# Altium schematic sheet MezcladorBF998.SchDoc
size A4
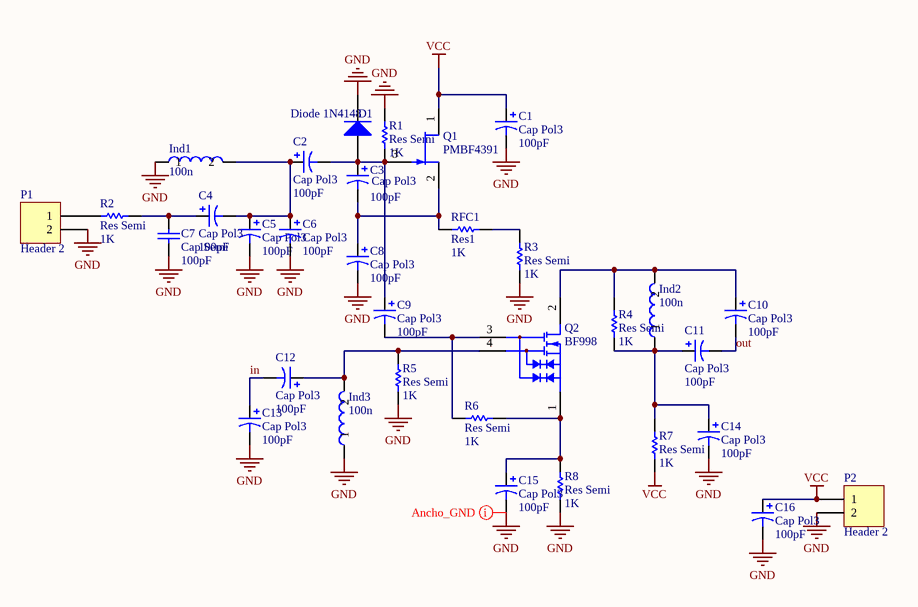
[diagram p0: MezcladorBF998.SchDoc]

## Parts
C1  Cap Pol3  value 100pF  [C0805]
C2  Cap Pol3  value 100pF  [C0805]
C3  Cap Pol3  value 100pF  [C0805]
C4  Cap Pol3  value 100pF  [C0805]
C5  Cap Pol3  value 100pF  [C0805]
C6  Cap Pol3  value 100pF  [C0805]
C7  Cap Semi  value 100pF  [C1206]
C8  Cap Pol3  value 100pF  [C0805]
C9  Cap Pol3  value 100pF  [C0805]
C10  Cap Pol3  value 100pF  [C0805]
C11  Cap Pol3  value 100pF  [C0805]
C12  Cap Pol3  value 100pF  [C0805]
C13  Cap Pol3  value 100pF  [C0805]
C14  Cap Pol3  value 100pF  [C0805]
C15  Cap Pol3  value 100pF  [C0805]
C16  Cap Pol3  value 100pF  [C0805]
D1  Diode 1N4148  [DO-35]
Ind1  Valor: 100n  [Ind_3mm]  (hidden comment: Ind2)
Ind2  Valor: 100n  [IND_7MM]  (hidden comment: Ind2)
Ind3  Valor: 100n  [Ind_4mm]  (hidden comment: Ind2)
P1  Header 2  [HDR1X2]
P2  Header 2  [HDR1X2]
Q1  PMBF4391  [SOT23]
Q2  BF998  [SOT143]
R1  Res Semi  value 1K  [2012[0805]]
R2  Res Semi  value 1K  [2012[0805]]
R3  Res Semi  value 1K  [2012[0805]]
R4  Res Semi  value 1K  [2012[0805]]
R5  Res Semi  value 1K  [2012[0805]]
R6  Res Semi  value 1K  [2012[0805]]
R7  Res Semi  value 1K  [2012[0805]]
R8  Res Semi  value 1K  [2012[0805]]
RFC1  Res1  value 1K  [AXIAL-0.3]

## Nets
GND: C1.2 C5.2 C6.2 C7.2 C8.2 C13.2 C14.2 C15.2 C16.2 D1.2(K) Ind1.1 Ind3.1 P1.2 P2.2 R1.2 R3.1 R5.2 R8.1
VCC: C1.1 C16.1 P2.1 Q1.1(D) R7.2
in: C12.2 C13.1
out: C10.2 C11.2
NetC2_1: C2.1 C4.2 C5.1 C6.1 Ind1.2
NetC2_2: C2.2 C3.1 C9.1 D1.1(A) Q1.3(G) R1.1
NetC3_2: C3.2 C8.1 Q1.2(S) RFC1.1
NetC4_1: C4.1 C7.1 R2.2
NetC9_2: C9.2 Q2.3(G2) R6.2
NetC10_1: C10.1 Ind2.2 Q2.2(D) R4.1
NetC11_1: C11.1 C14.1 Ind2.1 R4.2 R7.1
NetC12_1: C12.1 Ind3.2 Q2.4(G1) R5.1
NetC15_1: C15.1 Q2.1(S) R6.1 R8.2
NetP1_1: P1.1 R2.1
NetR3_2: R3.2 RFC1.2

## Layout directives
rule Width Constraint [Pref Width = 1mm    Min Width = 0.2mm    Max Width = 3mm]: GND

## Library data of the parts
C1-C6 C8-C16 = Cap Pol3: Polarized Capacitor (Surface Mount); Published: 8-Jun-2000; LatestRevisionDate: 17-Jul-2002; LatestRevisionNote: Re-released for DXP Platform.; PackageReference: C0805; Publisher: Altium Limited
C7 = Cap Semi: Capacitor (Semiconductor SIM Model); Published: 8-Jun-2000; LatestRevisionDate: 17-Jul-2002; LatestRevisionNote: Re-released for DXP Platform.; PackageReference: C1206; Publisher: Altium Limited
D1 = Diode 1N4148: High Conductance Fast Diode; Published: 8-Jun-2000; LatestRevisionDate: 17-Jul-2002; LatestRevisionNote: Re-released for DXP Platform.; DatasheetDocument: 1997; PackageReference: DO-35; Publisher: Altium Limited; Code_JEDEC: DO-204-AH; ComponentLink1Description: Manufacturer Link; ComponentLink1URL: http://www.fairchildsemi.com/; ComponentLink2Description: Datasheet; ComponentLink2URL: http://www.fairchildsemi.com/ds/1N%2F1N4148.pdf
P1 P2 = Header 2: Header, 2-Pin; LatestRevisionDate: 17-Jul-2002; LatestRevisionNote: Re-released for DXP Platform.; Publisher: Altium Limited
Q1 = PMBF4391: N-channel Silicon Junction Field-effect Transistor; Published: 17-Sep-2003; DatasheetDocument: Apr-1995; PackageDocument: May-1999; PackageReference: SOT23; Publisher: Altium Limited; ComponentLink1Description: Manufacturer Link; ComponentLink1URL: http://www.semiconductors.philips.com/; ComponentLink2Description: Datasheet; ComponentLink2URL: http://www.semiconductors.philips.com/acrobat/datasheets/PMBF4391_4392_4393_CNV_2.pdf
Q2 = BF998: Silicon N-channel Dual-gate MOSFET; Published: 17-Sep-2003; DatasheetDocument: Aug-1996; PackageDocument: Sep-1996; PackageReference: SOT143; Publisher: Altium Limited; ComponentLink1Description: Manufacturer Link; ComponentLink1URL: http://www.semiconductors.philips.com/; ComponentLink2Description: Datasheet; ComponentLink2URL: http://www.semiconductors.philips.com/acrobat/datasheets/BF998_2.pdf
R1-R8 = Res Semi: Semiconductor Resistor; Published: 8-Jun-2000; LatestRevisionDate: 17-Jul-2002; LatestRevisionNote: Re-released for DXP Platform.; PackageReference: AXIAL-0.5; Publisher: Altium Limited
RFC1 = Res1: Resistor; Published: 8-Jun-2000; LatestRevisionDate: 17-Jul-2002; LatestRevisionNote: Re-released for DXP Platform.; PackageReference: AXIAL-0.3; Publisher: Altium Limited